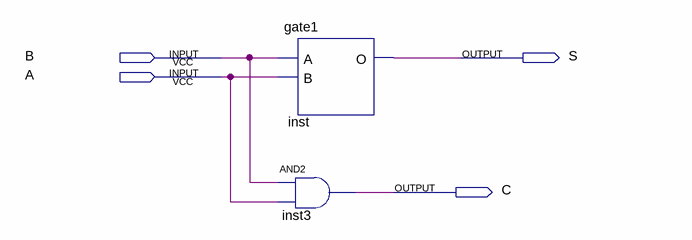
[diagram p0: schematic sheet]
// Quartus schematic halfAdder.bdf as structural Verilog: 2 symbols, 4 pins
module halfAdder (
  input  B,
  input  A,
  output S,
  output C
);

  gate1 inst (.A(B), .B(A), .O(S));
  and inst3 (C, B, A);
endmodule
